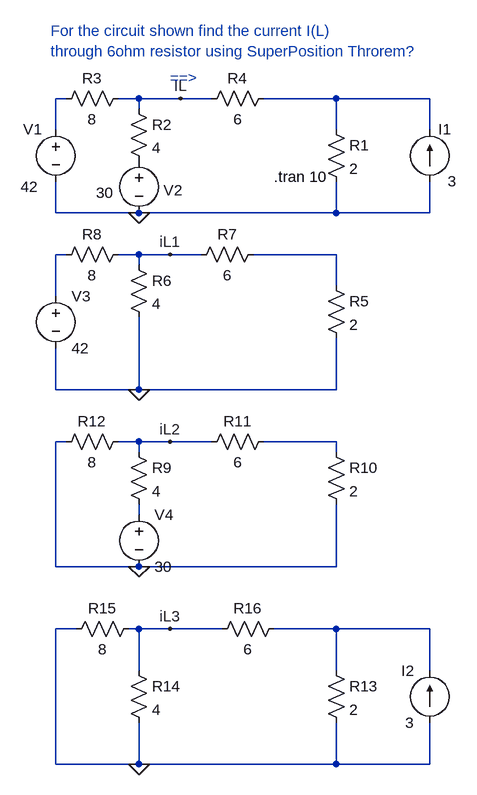
[diagram p0: schematic Lab1_ques4.asc]
Lab1_ques4.asc, the LTspice schematic file:
Version 4
SHEET 1 880 1216
WIRE -32 176 -48 176
WIRE 80 176 48 176
WIRE 144 176 80 176
WIRE 192 176 144 176
WIRE 384 176 272 176
WIRE 528 176 384 176
WIRE 80 192 80 176
WIRE -48 224 -48 176
WIRE 384 224 384 176
WIRE 528 224 528 176
WIRE -48 352 -48 304
WIRE 80 352 -48 352
WIRE 384 352 384 304
WIRE 384 352 80 352
WIRE 528 352 528 304
WIRE 528 352 384 352
WIRE -32 416 -48 416
WIRE 80 416 48 416
WIRE 128 416 80 416
WIRE 176 416 128 416
WIRE 384 416 256 416
WIRE 80 432 80 416
WIRE 384 464 384 416
WIRE -48 480 -48 416
WIRE -48 624 -48 560
WIRE 80 624 80 512
WIRE 80 624 -48 624
WIRE 384 624 384 544
WIRE 384 624 80 624
WIRE -32 704 -48 704
WIRE 80 704 48 704
WIRE 128 704 80 704
WIRE 192 704 128 704
WIRE 384 704 272 704
WIRE 80 720 80 704
WIRE 384 720 384 704
WIRE 80 816 80 800
WIRE -48 896 -48 704
WIRE 80 896 -48 896
WIRE 384 896 384 800
WIRE 384 896 80 896
WIRE -16 992 -48 992
WIRE 80 992 64 992
WIRE 128 992 80 992
WIRE 208 992 128 992
WIRE 384 992 288 992
WIRE 528 992 384 992
WIRE 80 1056 80 992
WIRE 384 1056 384 992
WIRE 528 1056 528 992
WIRE -48 1200 -48 992
WIRE 80 1200 80 1136
WIRE 80 1200 -48 1200
WIRE 384 1200 384 1136
WIRE 384 1200 80 1200
WIRE 528 1200 528 1136
WIRE 528 1200 384 1200
FLAG 144 176 IL
FLAG 128 416 iL1
FLAG 128 704 iL2
FLAG 80 1200 0
FLAG 80 896 0
FLAG 80 624 0
FLAG 80 352 0
FLAG 128 992 iL3
SYMBOL Res 368 208 R0
SYMATTR InstName R1
SYMATTR Value 2
SYMBOL Res 64 176 R0
SYMATTR InstName R2
SYMATTR Value 4
SYMBOL Res 64 160 R90
WINDOW 0 0 56 VBottom 2
WINDOW 3 32 56 VTop 2
SYMATTR InstName R3
SYMATTR Value 8
SYMBOL Res 288 160 R90
WINDOW 0 0 56 VBottom 2
WINDOW 3 32 56 VTop 2
SYMATTR InstName R4
SYMATTR Value 6
SYMBOL current 528 304 R180
WINDOW 0 -33 81 Left 2
WINDOW 3 -41 1 Left 2
SYMATTR InstName I1
SYMATTR Value 3
SYMBOL voltage -48 208 R0
WINDOW 0 -50 15 Left 2
WINDOW 3 -54 104 Left 2
SYMATTR InstName V1
SYMATTR Value 42
SYMBOL voltage 80 256 R0
WINDOW 0 38 61 Left 2
WINDOW 3 -66 65 Left 2
SYMATTR InstName V2
SYMATTR Value 30
SYMBOL Res 368 448 R0
SYMATTR InstName R5
SYMATTR Value 2
SYMBOL Res 64 416 R0
SYMATTR InstName R6
SYMATTR Value 4
SYMBOL Res 272 400 R90
WINDOW 0 0 56 VBottom 2
WINDOW 3 32 56 VTop 2
SYMATTR InstName R7
SYMATTR Value 6
SYMBOL Res 64 400 R90
WINDOW 0 0 56 VBottom 2
WINDOW 3 32 56 VTop 2
SYMATTR InstName R8
SYMATTR Value 8
SYMBOL voltage -48 464 R0
SYMATTR InstName V3
SYMATTR Value 42
SYMBOL Res 64 704 R0
SYMATTR InstName R9
SYMATTR Value 4
SYMBOL Res 368 704 R0
SYMATTR InstName R10
SYMATTR Value 2
SYMBOL Res 288 688 R90
WINDOW 0 0 56 VBottom 2
WINDOW 3 32 56 VTop 2
SYMATTR InstName R11
SYMATTR Value 6
SYMBOL Res 64 688 R90
WINDOW 0 0 56 VBottom 2
WINDOW 3 32 56 VTop 2
SYMATTR InstName R12
SYMATTR Value 8
SYMBOL voltage 80 800 R0
SYMATTR InstName V4
SYMATTR Value 30
SYMBOL Res 368 1040 R0
SYMATTR InstName R13
SYMATTR Value 2
SYMBOL Res 64 1040 R0
SYMATTR InstName R14
SYMATTR Value 4
SYMBOL Res 80 976 R90
WINDOW 0 0 56 VBottom 2
WINDOW 3 32 56 VTop 2
SYMATTR InstName R15
SYMATTR Value 8
SYMBOL Res 304 976 R90
WINDOW 0 0 56 VBottom 2
WINDOW 3 32 56 VTop 2
SYMATTR InstName R16
SYMATTR Value 6
SYMBOL current 528 1136 R180
WINDOW 0 24 80 Left 2
WINDOW 3 24 0 Left 2
SYMATTR InstName I2
SYMATTR Value 3
TEXT -56 72 Left 2 ;For the circuit shown find the current I(L) \nthrough 6ohm resistor using SuperPosition Throrem?
TEXT 128 144 Left 2 ;==>
TEXT 288 296 Left 2 !.tran 10

The netlist it stands for:
* Lab1_ques4.asc
R1 N002 0 2
R2 IL P001 4
R3 IL N001 8
R4 N002 IL 6
I1 0 N002 3
V1 N001 0 42
V2 P001 0 30
R5 N004 0 2
R6 iL1 0 4
R7 N004 iL1 6
R8 iL1 N003 8
V3 N003 0 42
R9 iL2 N006 4
R10 N005 0 2
R11 N005 iL2 6
R12 iL2 0 8
V4 N006 0 30
R13 N007 0 2
R14 iL3 0 4
R15 iL3 0 8
R16 N007 iL3 6
I2 0 N007 3
* For the circuit shown find the current I(L)
* through 6ohm resistor using SuperPosition Throrem?
* ==>
.tran 10
.backanno
.end